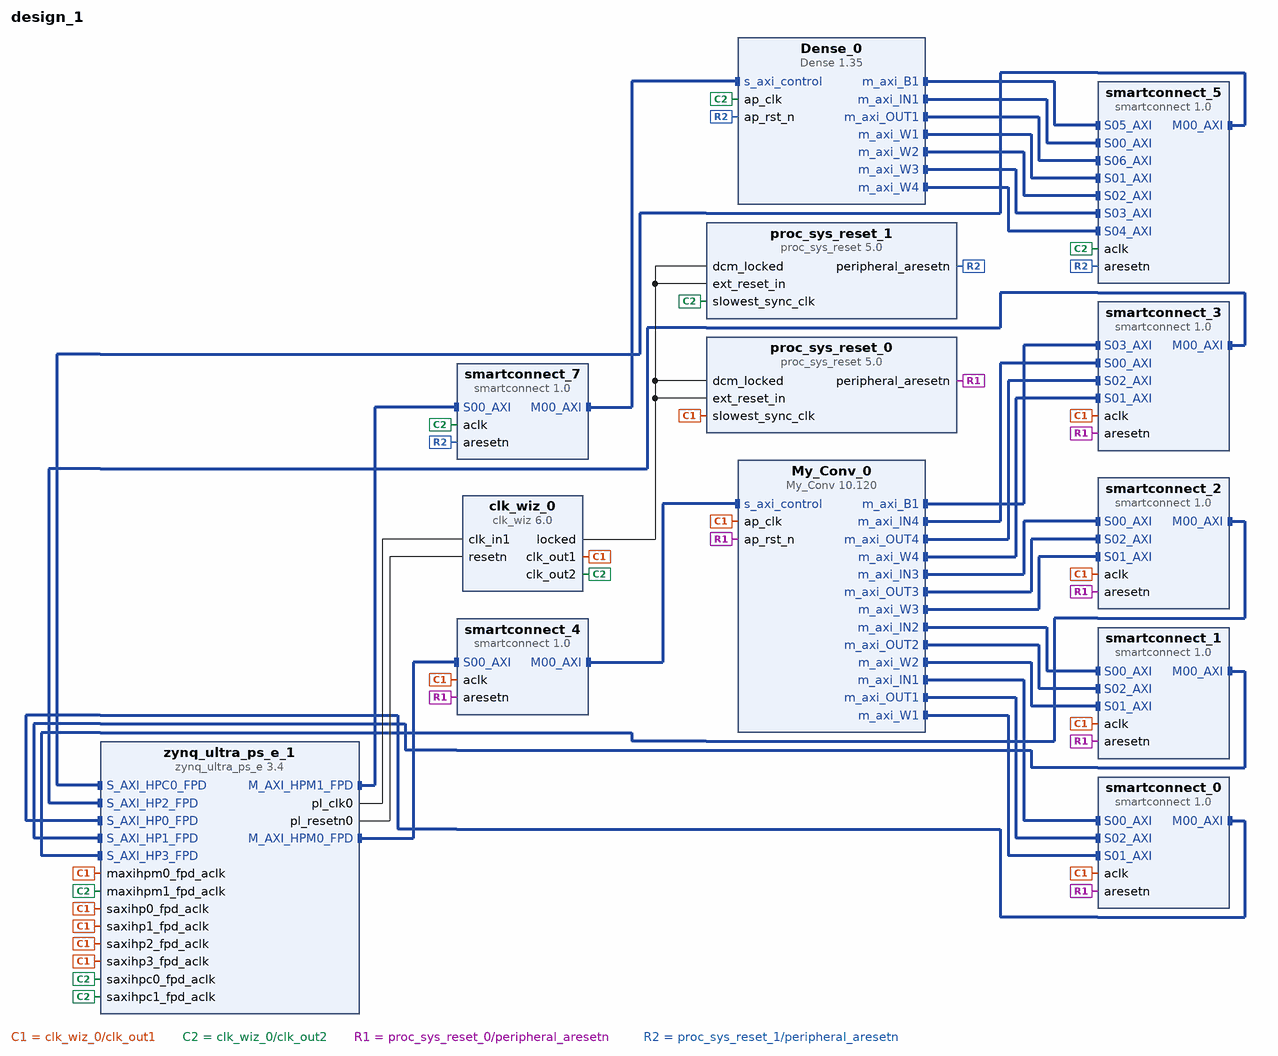
[diagram p0: block diagram of the top level]
# Vivado block design design_1, xck26-sfvc784-2LV-c, Vivado 2022.1
create_bd_design design_1

create_bd_cell -type ip -vlnv xilinx.com:ip:clk_wiz:6.0 clk_wiz_0
set_property -dict [list \
  CONFIG.CLKOUT1_JITTER 130.243 \
  CONFIG.CLKOUT1_PHASE_ERROR 241.709 \
  CONFIG.CLKOUT1_REQUESTED_OUT_FREQ 200 \
  CONFIG.CLKOUT2_JITTER 134.232 \
  CONFIG.CLKOUT2_PHASE_ERROR 241.709 \
  CONFIG.CLKOUT2_REQUESTED_OUT_FREQ 155 \
  CONFIG.CLKOUT2_USED true \
  CONFIG.MMCM_CLKFBOUT_MULT_F 127.875 \
  CONFIG.MMCM_CLKIN2_PERIOD 10.000 \
  CONFIG.MMCM_CLKOUT0_DIVIDE_F 7.750 \
  CONFIG.MMCM_CLKOUT1_DIVIDE 10 \
  CONFIG.MMCM_DIVCLK_DIVIDE 8 \
  CONFIG.NUM_OUT_CLKS 2 \
  CONFIG.RESET_PORT resetn \
  CONFIG.RESET_TYPE ACTIVE_LOW \
] [get_bd_cells clk_wiz_0]
create_bd_cell -type ip -vlnv xilinx.com:ip:proc_sys_reset:5.0 proc_sys_reset_0
create_bd_cell -type ip -vlnv xilinx.com:ip:zynq_ultra_ps_e:3.4 zynq_ultra_ps_e_1
set_property -dict [list \
  CONFIG.PSU__DDR_HIGH_ADDRESS_GUI_ENABLE 0 \
  CONFIG.PSU__MAXIGP0__DATA_WIDTH 128 \
  CONFIG.PSU__USE__M_AXI_GP0 1 \
  CONFIG.PSU__USE__M_AXI_GP1 1 \
  CONFIG.PSU__USE__M_AXI_GP2 0 \
  CONFIG.PSU__USE__S_AXI_GP0 1 \
  CONFIG.PSU__USE__S_AXI_GP1 1 \
  CONFIG.PSU__USE__S_AXI_GP2 1 \
  CONFIG.PSU__USE__S_AXI_GP3 1 \
  CONFIG.PSU__USE__S_AXI_GP4 1 \
  CONFIG.PSU__USE__S_AXI_GP5 1 \
] [get_bd_cells zynq_ultra_ps_e_1]
# 13 more settings of zynq_ultra_ps_e_1 are not shown: defaults, MIO pin electricals, DDR timing, and values the tool derives
create_bd_cell -type ip -vlnv xilinx.com:ip:smartconnect:1.0 smartconnect_0
set_property -dict {CONFIG.NUM_SI 3} [get_bd_cells smartconnect_0]
create_bd_cell -type ip -vlnv xilinx.com:ip:smartconnect:1.0 smartconnect_2
set_property -dict {CONFIG.NUM_SI 3} [get_bd_cells smartconnect_2]
create_bd_cell -type ip -vlnv xilinx.com:ip:smartconnect:1.0 smartconnect_3
set_property -dict {CONFIG.NUM_SI 4} [get_bd_cells smartconnect_3]
create_bd_cell -type ip -vlnv xilinx.com:ip:smartconnect:1.0 smartconnect_1
set_property -dict {CONFIG.NUM_SI 3} [get_bd_cells smartconnect_1]
create_bd_cell -type ip -vlnv xilinx.com:ip:smartconnect:1.0 smartconnect_4
set_property -dict {CONFIG.NUM_MI 1 CONFIG.NUM_SI 1} [get_bd_cells smartconnect_4]
create_bd_cell -type ip -vlnv xilinx.com:ip:smartconnect:1.0 smartconnect_5
set_property -dict {CONFIG.NUM_MI 1 CONFIG.NUM_SI 7} [get_bd_cells smartconnect_5]
create_bd_cell -type ip -vlnv xilinx.com:ip:proc_sys_reset:5.0 proc_sys_reset_1
create_bd_cell -type ip -vlnv xilinx.com:ip:smartconnect:1.0 smartconnect_7
set_property -dict {CONFIG.NUM_MI 1 CONFIG.NUM_SI 1} [get_bd_cells smartconnect_7]
create_bd_cell -type ip -vlnv xilinx.com:hls:Dense:1.35 Dense_0
create_bd_cell -type ip -vlnv xilinx.com:hls:My_Conv:10.120 My_Conv_0
set_property -dict [list \
  CONFIG.C_M_AXI_B1_DATA_WIDTH 32 \
  CONFIG.C_M_AXI_IN1_DATA_WIDTH 32 \
  CONFIG.C_M_AXI_IN2_DATA_WIDTH 32 \
  CONFIG.C_M_AXI_IN3_DATA_WIDTH 32 \
  CONFIG.C_M_AXI_IN4_DATA_WIDTH 32 \
  CONFIG.C_M_AXI_OUT1_DATA_WIDTH 32 \
  CONFIG.C_M_AXI_OUT2_DATA_WIDTH 32 \
  CONFIG.C_M_AXI_OUT3_DATA_WIDTH 32 \
  CONFIG.C_M_AXI_OUT4_DATA_WIDTH 32 \
  CONFIG.C_M_AXI_W1_DATA_WIDTH 32 \
  CONFIG.C_M_AXI_W2_DATA_WIDTH 32 \
  CONFIG.C_M_AXI_W3_DATA_WIDTH 32 \
  CONFIG.C_M_AXI_W4_DATA_WIDTH 32 \
] [get_bd_cells My_Conv_0]

# ---- connections ----

connect_bd_intf_net [get_bd_intf_pins Dense_0/m_axi_B1] [get_bd_intf_pins smartconnect_5/S05_AXI]
connect_bd_intf_net [get_bd_intf_pins Dense_0/m_axi_IN1] [get_bd_intf_pins smartconnect_5/S00_AXI]
connect_bd_intf_net [get_bd_intf_pins smartconnect_5/S06_AXI] [get_bd_intf_pins Dense_0/m_axi_OUT1]
connect_bd_intf_net [get_bd_intf_pins Dense_0/m_axi_W1] [get_bd_intf_pins smartconnect_5/S01_AXI]
connect_bd_intf_net [get_bd_intf_pins Dense_0/m_axi_W2] [get_bd_intf_pins smartconnect_5/S02_AXI]
connect_bd_intf_net [get_bd_intf_pins Dense_0/m_axi_W3] [get_bd_intf_pins smartconnect_5/S03_AXI]
connect_bd_intf_net [get_bd_intf_pins Dense_0/m_axi_W4] [get_bd_intf_pins smartconnect_5/S04_AXI]
connect_bd_intf_net [get_bd_intf_pins My_Conv_0/m_axi_B1] [get_bd_intf_pins smartconnect_3/S03_AXI]
connect_bd_intf_net [get_bd_intf_pins My_Conv_0/m_axi_IN1] [get_bd_intf_pins smartconnect_0/S00_AXI]
connect_bd_intf_net [get_bd_intf_pins My_Conv_0/m_axi_IN2] [get_bd_intf_pins smartconnect_1/S00_AXI]
connect_bd_intf_net [get_bd_intf_pins My_Conv_0/m_axi_IN3] [get_bd_intf_pins smartconnect_2/S00_AXI]
connect_bd_intf_net [get_bd_intf_pins My_Conv_0/m_axi_IN4] [get_bd_intf_pins smartconnect_3/S00_AXI]
connect_bd_intf_net [get_bd_intf_pins My_Conv_0/m_axi_OUT1] [get_bd_intf_pins smartconnect_0/S02_AXI]
connect_bd_intf_net [get_bd_intf_pins My_Conv_0/m_axi_OUT2] [get_bd_intf_pins smartconnect_1/S02_AXI]
connect_bd_intf_net [get_bd_intf_pins My_Conv_0/m_axi_OUT3] [get_bd_intf_pins smartconnect_2/S02_AXI]
connect_bd_intf_net [get_bd_intf_pins My_Conv_0/m_axi_OUT4] [get_bd_intf_pins smartconnect_3/S02_AXI]
connect_bd_intf_net [get_bd_intf_pins My_Conv_0/m_axi_W1] [get_bd_intf_pins smartconnect_0/S01_AXI]
connect_bd_intf_net [get_bd_intf_pins My_Conv_0/m_axi_W2] [get_bd_intf_pins smartconnect_1/S01_AXI]
connect_bd_intf_net [get_bd_intf_pins My_Conv_0/m_axi_W3] [get_bd_intf_pins smartconnect_2/S01_AXI]
connect_bd_intf_net [get_bd_intf_pins My_Conv_0/m_axi_W4] [get_bd_intf_pins smartconnect_3/S01_AXI]
connect_bd_intf_net [get_bd_intf_pins smartconnect_0/M00_AXI] [get_bd_intf_pins zynq_ultra_ps_e_1/S_AXI_HP0_FPD]
connect_bd_intf_net [get_bd_intf_pins smartconnect_1/M00_AXI] [get_bd_intf_pins zynq_ultra_ps_e_1/S_AXI_HP1_FPD]
connect_bd_intf_net [get_bd_intf_pins smartconnect_2/M00_AXI] [get_bd_intf_pins zynq_ultra_ps_e_1/S_AXI_HP3_FPD]
connect_bd_intf_net [get_bd_intf_pins smartconnect_3/M00_AXI] [get_bd_intf_pins zynq_ultra_ps_e_1/S_AXI_HP2_FPD]
connect_bd_intf_net [get_bd_intf_pins My_Conv_0/s_axi_control] [get_bd_intf_pins smartconnect_4/M00_AXI]
connect_bd_intf_net [get_bd_intf_pins zynq_ultra_ps_e_1/S_AXI_HPC0_FPD] [get_bd_intf_pins smartconnect_5/M00_AXI]
connect_bd_intf_net [get_bd_intf_pins smartconnect_7/M00_AXI] [get_bd_intf_pins Dense_0/s_axi_control]
connect_bd_intf_net [get_bd_intf_pins smartconnect_4/S00_AXI] [get_bd_intf_pins zynq_ultra_ps_e_1/M_AXI_HPM0_FPD]
connect_bd_intf_net [get_bd_intf_pins smartconnect_7/S00_AXI] [get_bd_intf_pins zynq_ultra_ps_e_1/M_AXI_HPM1_FPD]
connect_bd_net [get_bd_pins clk_wiz_0/clk_out1] \
  [get_bd_pins proc_sys_reset_0/slowest_sync_clk] [get_bd_pins smartconnect_3/aclk] [get_bd_pins smartconnect_2/aclk] \
  [get_bd_pins smartconnect_1/aclk] [get_bd_pins smartconnect_0/aclk] [get_bd_pins smartconnect_4/aclk] \
  [get_bd_pins zynq_ultra_ps_e_1/saxihp3_fpd_aclk] [get_bd_pins zynq_ultra_ps_e_1/saxihp2_fpd_aclk] \
  [get_bd_pins zynq_ultra_ps_e_1/saxihp1_fpd_aclk] [get_bd_pins zynq_ultra_ps_e_1/saxihp0_fpd_aclk] \
  [get_bd_pins zynq_ultra_ps_e_1/maxihpm0_fpd_aclk] [get_bd_pins My_Conv_0/ap_clk]
connect_bd_net [get_bd_pins clk_wiz_0/clk_out2] \
  [get_bd_pins proc_sys_reset_1/slowest_sync_clk] [get_bd_pins zynq_ultra_ps_e_1/saxihpc1_fpd_aclk] \
  [get_bd_pins zynq_ultra_ps_e_1/saxihpc0_fpd_aclk] [get_bd_pins zynq_ultra_ps_e_1/maxihpm1_fpd_aclk] \
  [get_bd_pins smartconnect_7/aclk] [get_bd_pins smartconnect_5/aclk] [get_bd_pins Dense_0/ap_clk]
connect_bd_net [get_bd_pins clk_wiz_0/locked] \
  [get_bd_pins proc_sys_reset_0/dcm_locked] [get_bd_pins proc_sys_reset_0/ext_reset_in] \
  [get_bd_pins proc_sys_reset_1/ext_reset_in] [get_bd_pins proc_sys_reset_1/dcm_locked]
connect_bd_net [get_bd_pins proc_sys_reset_0/peripheral_aresetn] \
  [get_bd_pins smartconnect_3/aresetn] [get_bd_pins smartconnect_2/aresetn] [get_bd_pins smartconnect_1/aresetn] \
  [get_bd_pins smartconnect_0/aresetn] [get_bd_pins smartconnect_4/aresetn] [get_bd_pins My_Conv_0/ap_rst_n]
connect_bd_net [get_bd_pins proc_sys_reset_1/peripheral_aresetn] \
  [get_bd_pins smartconnect_7/aresetn] [get_bd_pins smartconnect_5/aresetn] [get_bd_pins Dense_0/ap_rst_n]
connect_bd_net [get_bd_pins zynq_ultra_ps_e_1/pl_clk0] [get_bd_pins clk_wiz_0/clk_in1]
connect_bd_net [get_bd_pins zynq_ultra_ps_e_1/pl_resetn0] [get_bd_pins clk_wiz_0/resetn]

# ---- address map ----
assign_bd_address -offset 0x0000000000000000 -range 2G -target_address_space [get_bd_addr_spaces Dense_0/Data_m_axi_B1] [get_bd_addr_segs zynq_ultra_ps_e_1/SAXIGP0/HPC0_DDR_LOW]
exclude_bd_addr_seg -offset 0x00000000FF000000 -range 16M -target_address_space [get_bd_addr_spaces Dense_0/Data_m_axi_B1] [get_bd_addr_segs zynq_ultra_ps_e_1/SAXIGP0/HPC0_LPS_OCM]
assign_bd_address -offset 0x0000000000000000 -range 2G -target_address_space [get_bd_addr_spaces Dense_0/Data_m_axi_IN1] [get_bd_addr_segs zynq_ultra_ps_e_1/SAXIGP0/HPC0_DDR_LOW]
exclude_bd_addr_seg -offset 0x00000000FF000000 -range 16M -target_address_space [get_bd_addr_spaces Dense_0/Data_m_axi_IN1] [get_bd_addr_segs zynq_ultra_ps_e_1/SAXIGP0/HPC0_LPS_OCM]
assign_bd_address -offset 0x0000000000000000 -range 2G -target_address_space [get_bd_addr_spaces Dense_0/Data_m_axi_OUT1] [get_bd_addr_segs zynq_ultra_ps_e_1/SAXIGP0/HPC0_DDR_LOW]
exclude_bd_addr_seg -offset 0x00000000FF000000 -range 16M -target_address_space [get_bd_addr_spaces Dense_0/Data_m_axi_OUT1] [get_bd_addr_segs zynq_ultra_ps_e_1/SAXIGP0/HPC0_LPS_OCM]
assign_bd_address -offset 0x0000000000000000 -range 2G -target_address_space [get_bd_addr_spaces Dense_0/Data_m_axi_W1] [get_bd_addr_segs zynq_ultra_ps_e_1/SAXIGP0/HPC0_DDR_LOW]
exclude_bd_addr_seg -offset 0x00000000FF000000 -range 16M -target_address_space [get_bd_addr_spaces Dense_0/Data_m_axi_W1] [get_bd_addr_segs zynq_ultra_ps_e_1/SAXIGP0/HPC0_LPS_OCM]
assign_bd_address -offset 0x0000000000000000 -range 2G -target_address_space [get_bd_addr_spaces Dense_0/Data_m_axi_W2] [get_bd_addr_segs zynq_ultra_ps_e_1/SAXIGP0/HPC0_DDR_LOW]
exclude_bd_addr_seg -offset 0x00000000FF000000 -range 16M -target_address_space [get_bd_addr_spaces Dense_0/Data_m_axi_W2] [get_bd_addr_segs zynq_ultra_ps_e_1/SAXIGP0/HPC0_LPS_OCM]
assign_bd_address -offset 0x0000000000000000 -range 2G -target_address_space [get_bd_addr_spaces Dense_0/Data_m_axi_W3] [get_bd_addr_segs zynq_ultra_ps_e_1/SAXIGP0/HPC0_DDR_LOW]
exclude_bd_addr_seg -offset 0x00000000FF000000 -range 16M -target_address_space [get_bd_addr_spaces Dense_0/Data_m_axi_W3] [get_bd_addr_segs zynq_ultra_ps_e_1/SAXIGP0/HPC0_LPS_OCM]
assign_bd_address -offset 0x0000000000000000 -range 2G -target_address_space [get_bd_addr_spaces Dense_0/Data_m_axi_W4] [get_bd_addr_segs zynq_ultra_ps_e_1/SAXIGP0/HPC0_DDR_LOW]
exclude_bd_addr_seg -offset 0x00000000FF000000 -range 16M -target_address_space [get_bd_addr_spaces Dense_0/Data_m_axi_W4] [get_bd_addr_segs zynq_ultra_ps_e_1/SAXIGP0/HPC0_LPS_OCM]
assign_bd_address -offset 0x0000000000000000 -range 2G -target_address_space [get_bd_addr_spaces My_Conv_0/Data_m_axi_B1] [get_bd_addr_segs zynq_ultra_ps_e_1/SAXIGP4/HP2_DDR_LOW]
exclude_bd_addr_seg -offset 0x00000000FF000000 -range 16M -target_address_space [get_bd_addr_spaces My_Conv_0/Data_m_axi_B1] [get_bd_addr_segs zynq_ultra_ps_e_1/SAXIGP4/HP2_LPS_OCM]
assign_bd_address -offset 0x0000000000000000 -range 2G -target_address_space [get_bd_addr_spaces My_Conv_0/Data_m_axi_IN1] [get_bd_addr_segs zynq_ultra_ps_e_1/SAXIGP2/HP0_DDR_LOW]
exclude_bd_addr_seg -offset 0x00000000FF000000 -range 16M -target_address_space [get_bd_addr_spaces My_Conv_0/Data_m_axi_IN1] [get_bd_addr_segs zynq_ultra_ps_e_1/SAXIGP2/HP0_LPS_OCM]
assign_bd_address -offset 0x0000000000000000 -range 2G -target_address_space [get_bd_addr_spaces My_Conv_0/Data_m_axi_IN2] [get_bd_addr_segs zynq_ultra_ps_e_1/SAXIGP3/HP1_DDR_LOW]
exclude_bd_addr_seg -offset 0x00000000FF000000 -range 16M -target_address_space [get_bd_addr_spaces My_Conv_0/Data_m_axi_IN2] [get_bd_addr_segs zynq_ultra_ps_e_1/SAXIGP3/HP1_LPS_OCM]
assign_bd_address -offset 0x0000000000000000 -range 2G -target_address_space [get_bd_addr_spaces My_Conv_0/Data_m_axi_IN3] [get_bd_addr_segs zynq_ultra_ps_e_1/SAXIGP5/HP3_DDR_LOW]
exclude_bd_addr_seg -offset 0x00000000FF000000 -range 16M -target_address_space [get_bd_addr_spaces My_Conv_0/Data_m_axi_IN3] [get_bd_addr_segs zynq_ultra_ps_e_1/SAXIGP5/HP3_LPS_OCM]
assign_bd_address -offset 0x0000000000000000 -range 2G -target_address_space [get_bd_addr_spaces My_Conv_0/Data_m_axi_IN4] [get_bd_addr_segs zynq_ultra_ps_e_1/SAXIGP4/HP2_DDR_LOW]
exclude_bd_addr_seg -offset 0x00000000FF000000 -range 16M -target_address_space [get_bd_addr_spaces My_Conv_0/Data_m_axi_IN4] [get_bd_addr_segs zynq_ultra_ps_e_1/SAXIGP4/HP2_LPS_OCM]
assign_bd_address -offset 0x0000000000000000 -range 2G -target_address_space [get_bd_addr_spaces My_Conv_0/Data_m_axi_OUT1] [get_bd_addr_segs zynq_ultra_ps_e_1/SAXIGP2/HP0_DDR_LOW]
exclude_bd_addr_seg -offset 0x00000000FF000000 -range 16M -target_address_space [get_bd_addr_spaces My_Conv_0/Data_m_axi_OUT1] [get_bd_addr_segs zynq_ultra_ps_e_1/SAXIGP2/HP0_LPS_OCM]
assign_bd_address -offset 0x0000000000000000 -range 2G -target_address_space [get_bd_addr_spaces My_Conv_0/Data_m_axi_OUT2] [get_bd_addr_segs zynq_ultra_ps_e_1/SAXIGP3/HP1_DDR_LOW]
exclude_bd_addr_seg -offset 0x00000000FF000000 -range 16M -target_address_space [get_bd_addr_spaces My_Conv_0/Data_m_axi_OUT2] [get_bd_addr_segs zynq_ultra_ps_e_1/SAXIGP3/HP1_LPS_OCM]
assign_bd_address -offset 0x0000000000000000 -range 2G -target_address_space [get_bd_addr_spaces My_Conv_0/Data_m_axi_OUT3] [get_bd_addr_segs zynq_ultra_ps_e_1/SAXIGP5/HP3_DDR_LOW]
exclude_bd_addr_seg -offset 0x00000000FF000000 -range 16M -target_address_space [get_bd_addr_spaces My_Conv_0/Data_m_axi_OUT3] [get_bd_addr_segs zynq_ultra_ps_e_1/SAXIGP5/HP3_LPS_OCM]
assign_bd_address -offset 0x0000000000000000 -range 2G -target_address_space [get_bd_addr_spaces My_Conv_0/Data_m_axi_OUT4] [get_bd_addr_segs zynq_ultra_ps_e_1/SAXIGP4/HP2_DDR_LOW]
exclude_bd_addr_seg -offset 0x00000000FF000000 -range 16M -target_address_space [get_bd_addr_spaces My_Conv_0/Data_m_axi_OUT4] [get_bd_addr_segs zynq_ultra_ps_e_1/SAXIGP4/HP2_LPS_OCM]
assign_bd_address -offset 0x0000000000000000 -range 2G -target_address_space [get_bd_addr_spaces My_Conv_0/Data_m_axi_W1] [get_bd_addr_segs zynq_ultra_ps_e_1/SAXIGP2/HP0_DDR_LOW]
exclude_bd_addr_seg -offset 0x00000000FF000000 -range 16M -target_address_space [get_bd_addr_spaces My_Conv_0/Data_m_axi_W1] [get_bd_addr_segs zynq_ultra_ps_e_1/SAXIGP2/HP0_LPS_OCM]
assign_bd_address -offset 0x0000000000000000 -range 2G -target_address_space [get_bd_addr_spaces My_Conv_0/Data_m_axi_W2] [get_bd_addr_segs zynq_ultra_ps_e_1/SAXIGP3/HP1_DDR_LOW]
exclude_bd_addr_seg -offset 0x00000000FF000000 -range 16M -target_address_space [get_bd_addr_spaces My_Conv_0/Data_m_axi_W2] [get_bd_addr_segs zynq_ultra_ps_e_1/SAXIGP3/HP1_LPS_OCM]
assign_bd_address -offset 0x0000000000000000 -range 2G -target_address_space [get_bd_addr_spaces My_Conv_0/Data_m_axi_W3] [get_bd_addr_segs zynq_ultra_ps_e_1/SAXIGP5/HP3_DDR_LOW]
exclude_bd_addr_seg -offset 0x00000000FF000000 -range 16M -target_address_space [get_bd_addr_spaces My_Conv_0/Data_m_axi_W3] [get_bd_addr_segs zynq_ultra_ps_e_1/SAXIGP5/HP3_LPS_OCM]
assign_bd_address -offset 0x0000000000000000 -range 2G -target_address_space [get_bd_addr_spaces My_Conv_0/Data_m_axi_W4] [get_bd_addr_segs zynq_ultra_ps_e_1/SAXIGP4/HP2_DDR_LOW]
exclude_bd_addr_seg -offset 0x00000000FF000000 -range 16M -target_address_space [get_bd_addr_spaces My_Conv_0/Data_m_axi_W4] [get_bd_addr_segs zynq_ultra_ps_e_1/SAXIGP4/HP2_LPS_OCM]
assign_bd_address -offset 0x00A0000000 -range 64K -target_address_space [get_bd_addr_spaces zynq_ultra_ps_e_1/Data] [get_bd_addr_segs My_Conv_0/s_axi_control/Reg]
assign_bd_address -offset 0x00B0000000 -range 64K -target_address_space [get_bd_addr_spaces zynq_ultra_ps_e_1/Data] [get_bd_addr_segs Dense_0/s_axi_control/Reg]

validate_bd_design
save_bd_design
